# Altium project Temperature_PCB.PrjPcb
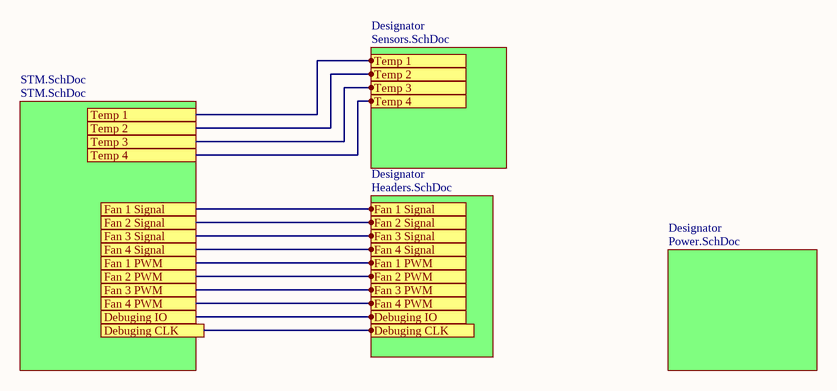
[diagram p0: TOP.SchDoc]
6 sheets, 44 parts. Net scope: global (net labels, ports and power ports of the same name join across sheets).
Board file: PCB.PcbDoc
Sheets:
  TOP.SchDoc
    STM.SchDoc = STM.SchDoc
      CAN = CANsetup.SchDoc
    Designator = Sensors.SchDoc
    Designator = Power.SchDoc
    Designator = Headers.SchDoc

## Sheet TOP.SchDoc: =DocumentName
size A4; Organization: Queen's Formula SAE; Address1: 130 Stuart St, Kingston; Address2: Ontario; Address3: Canada; Address4: K7L 2V9; DocumentNumber: 1; Revision: 0; SheetNumber: 1; SheetTotal: 1

### Sub-sheets
Designator = Sensors.SchDoc: Temp 1, Temp 2, Temp 3, Temp 4
Designator = Power.SchDoc: no entries
Designator = Headers.SchDoc: Fan 1 Signal, Fan 2 Signal, Fan 3 Signal, Fan 4 Signal, Fan 1 PWM, Fan 2 PWM, Fan 3 PWM, Fan 4 PWM, Debuging IO, Port
STM.SchDoc = STM.SchDoc: no entries

### Ports
Debuging CLK, Debuging IO, Fan 1 PWM, Fan 1 Signal, Fan 2 PWM, Fan 2 Signal, Fan 3 PWM, Fan 3 Signal, Fan 4 PWM, Fan 4 Signal, Temp 1, Temp 2, Temp 3, Temp 4

### Nets
Debuging CLK: port Debuging CLK, sheet Designator/Port
Debuging IO: port Debuging IO, sheet Designator/Debuging IO
Fan 1 PWM: port Fan 1 PWM, sheet Designator/Fan 1 PWM
Fan 1 Signal: port Fan 1 Signal, sheet Designator/Fan 1 Signal
Fan 2 PWM: port Fan 2 PWM, sheet Designator/Fan 2 PWM
Fan 2 Signal: port Fan 2 Signal, sheet Designator/Fan 2 Signal
Fan 3 PWM: port Fan 3 PWM, sheet Designator/Fan 3 PWM
Fan 3 Signal: port Fan 3 Signal, sheet Designator/Fan 3 Signal
Fan 4 PWM: port Fan 4 PWM, sheet Designator/Fan 4 PWM
Fan 4 Signal: port Fan 4 Signal, sheet Designator/Fan 4 Signal
Temp 1: port Temp 1, sheet Designator/Temp 1
Temp 2: port Temp 2, sheet Designator/Temp 2
Temp 3: port Temp 3, sheet Designator/Temp 3
Temp 4: port Temp 4, sheet Designator/Temp 4

### Notes on the sheet
- Title
- Size:
- Date:
- A4
- Number:
- Time:
- Revision:
- Sheet
- of
- File:

## Sheet STM.SchDoc
size A4
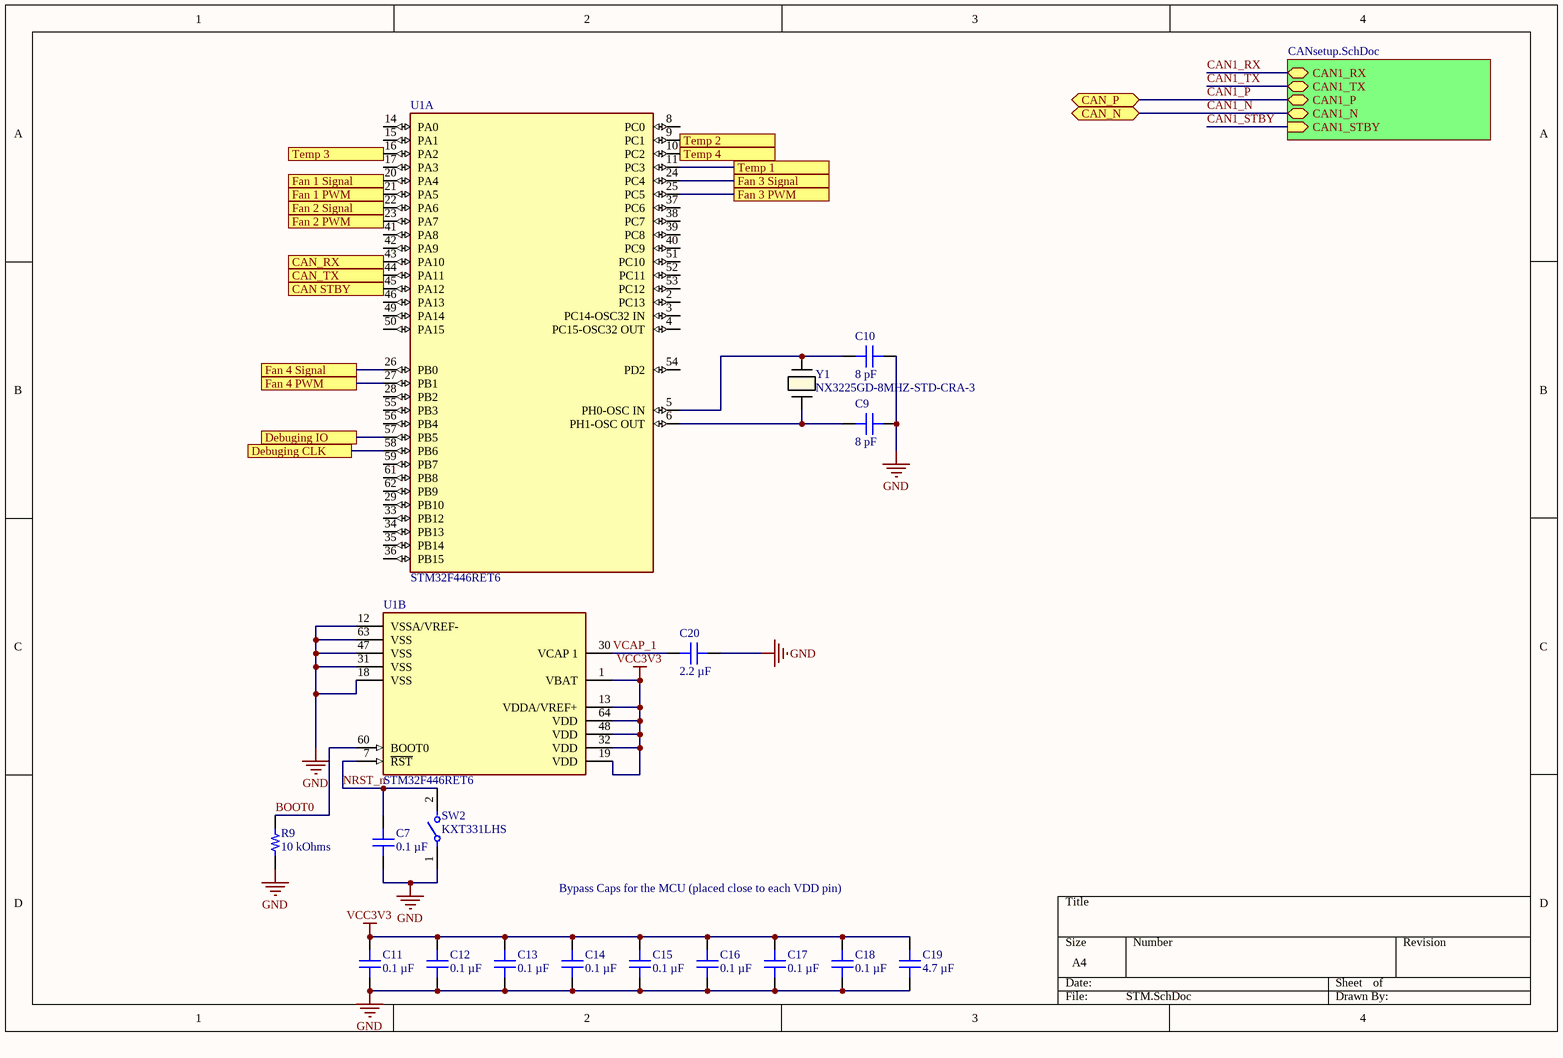
[diagram p1: STM.SchDoc]

### Parts
C7  0.1 µF  [CAP 01005_0402]
C9  8 pF  [CAP 0402_1005]
C10  8 pF  [CAP 0402_1005]
C11  0.1 µF  [CAP 01005_0402]
C12  0.1 µF  [CAP 01005_0402]
C13  0.1 µF  [CAP 01005_0402]
C14  0.1 µF  [CAP 01005_0402]
C15  0.1 µF  [CAP 01005_0402]
C16  0.1 µF  [CAP 01005_0402]
C17  0.1 µF  [CAP 01005_0402]
C18  0.1 µF  [CAP 01005_0402]
C19  4.7 µF  [CAP 0402_1005]
C20  2.2 µF  [CAP 0402_1005]
R9  10 kOhms  [RES 0201_0603]
SW2  KXT331LHS  [FP-KXT331LHS-MFG]
U1  STM32F446RET6  [FP-LQFP64-5W-MFG]  (parts A,B of 2)
Y1  NX3225GD-8MHZ-STD-CRA-3  [XTAL_NX3225GD-8MHZ-STD-CRA-3_NDK]

### Sub-sheets
CAN = CANsetup.SchDoc: CAN1_RX (bidir), CAN1_TX (bidir), CAN1_STBY (in), CAN1_P (bidir), CAN1_N (bidir)

### Ports
CAN STBY, CAN_N (bidir), CAN_P (bidir), CAN_RX, CAN_TX, Debuging CLK, Debuging IO, Fan 1 PWM, Fan 1 Signal, Fan 2 PWM, Fan 2 Signal, Fan 3 PWM, Fan 3 Signal, Fan 4 PWM, Fan 4 Signal, Temp 1, Temp 2, Temp 3, Temp 4

### Nets
GND: C7.2 C9.1 C10.1 C11.2 C12.2 C13.2 C14.2 C15.2 C16.2 C17.2 C18.2 C19.1 C20.1 R9.1 SW2.1 U1.12(VSSA/VREF-) U1.18(VSS) U1.31(VSS) U1.47(VSS) U1.63(VSS)
VCC3V3: C11.1 C12.1 C13.1 C14.1 C15.1 C16.1 C17.1 C18.1 C19.2 U1.1(VBAT) U1.13(VDDA/VREF+) U1.19(VDD) U1.32(VDD) U1.48(VDD) U1.64(VDD)
BOOT0: R9.2 U1.60(BOOT0)
CAN1_N: port CAN_N, sheet CAN/CAN1_N
CAN1_P: port CAN_P, sheet CAN/CAN1_P
CAN1_RX: sheet CAN/CAN1_RX
CAN1_STBY: sheet CAN/CAN1_STBY
CAN1_TX: sheet CAN/CAN1_TX
CAN STBY: U1.45(PA12) ; port CAN STBY
CAN_RX: U1.43(PA10) ; port CAN_RX
CAN_TX: U1.44(PA11) ; port CAN_TX
Debuging CLK: U1.58(PB6) ; port Debuging CLK
Debuging IO: U1.57(PB5) ; port Debuging IO
Fan 1 PWM: U1.21(PA5) ; port Fan 1 PWM
Fan 1 Signal: U1.20(PA4) ; port Fan 1 Signal
Fan 2 PWM: U1.23(PA7) ; port Fan 2 PWM
Fan 2 Signal: U1.22(PA6) ; port Fan 2 Signal
Fan 3 PWM: U1.25(PC5) ; port Fan 3 PWM
Fan 3 Signal: U1.24(PC4) ; port Fan 3 Signal
Fan 4 PWM: U1.27(PB1) ; port Fan 4 PWM
Fan 4 Signal: U1.26(PB0) ; port Fan 4 Signal
NRST_n: C7.1 SW2.2 U1.7(~{RST})
Temp 1: U1.11(PC3) ; port Temp 1
Temp 2: U1.9(PC1) ; port Temp 2
Temp 3: U1.16(PA2) ; port Temp 3
Temp 4: U1.10(PC2) ; port Temp 4
VCAP_1: C20.2 U1.30(VCAP_1)
NetC9_2: C9.2 U1.6(PH1-OSC_OUT) Y1.2
NetC10_2: C10.2 U1.5(PH0-OSC_IN) Y1.1

Not connected (* = marked no-connect by the designer): U1 2(PC13) 3(PC14-OSC32_IN) 4(PC15-OSC32_OUT) 8(PC0) 14(PA0) 15(PA1) 17(PA3) 28(PB2) 29(PB10) 33(PB12) 34(PB13) 35(PB14) 36(PB15) 37(PC6) 38(PC7) 39(PC8) 40(PC9) 41(PA8) 42(PA9) 46(PA13) 49(PA14) 50(PA15) 51(PC10) 52(PC11) 53(PC12) 54(PD2) 55(PB3) 56(PB4) 59(PB7) 61(PB8) 62(PB9)

### Notes on the sheet
- Bypass Caps for the MCU (placed close to each VDD pin)

### Library data of the parts
C7 C11-C18 = CL02A104KQ2NNNC: CAP CER 0.1UF 6.3V X5R 01005; manufacturer: Samsung Electro-Mechanics; Tolerance: ±10%; Part Number: CL02A104KQ2NNNC; Value: 0.1 µF; Applications: General Purpose; Capacitance: 0.1 µF; componentlink1description: Datasheet; componentlink1url: http://www.samsungsem.com/kr/support/product-search/mlcc/CL02A104KQ2NNNC.jsp; componentlink2description: DigiKey Link; componentlink2url: https://www.digikey.com/en/products/detail/samsung-electro-mechanics/CL02A104KQ2NNNC/3886867; Device Package: 01005 (0402 Metric); lastupdated: 2023-11-30 9:46:05 PM; Lifecycle Status: Active; Minimum Order: 1; Mounting Type: Surface Mount, MLCC; Operating Temperature: -55°C ~ 85°C; Package / Case: 01005 (0402 Metric); packaging: TapeAndReel; Part Status: Active; price: 0.02; series: CL; Size / Dimension: 0.016" L x 0.008" W (0.40mm x 0.20mm); Supplier 1: DigiKey; Supplier Part Number 1: 1276-1209-1-ND; Temperature Coefficient: X5R; Thickness (Max): 0.009" (0.22mm); Voltage - Rated: 6.3V
C9 C10 = GCM1555C1H8R0FA16D: CAP CER 8PF 50V C0G/NP0 0402; manufacturer: Murata Electronics; Temperature Coefficient: C0G, NP0; Tolerance: ±1%; Part Number: GCM1555C1H8R0FA16D; Value: 8 pF; Applications: Automotive; Capacitance: 8 pF; componentlink1description: Datasheet; componentlink1url: https://search.murata.co.jp/Ceramy/image/img/A01X/G101/ENG/GCM1555C1H8R0FA16-01.pdf; componentlink2description: DigiKey Link; componentlink2url: https://www.digikey.com/en/products/detail/murata-electronics/GCM1555C1H8R0FA16D/11618789; Device Package: 0402 (1005 Metric); lastupdated: 2024-01-11 8:04:05 PM; Lifecycle Status: Active; Minimum Order: 1; Mounting Type: Surface Mount, MLCC; Operating Temperature: -55°C ~ 125°C; Package / Case: 0402 (1005 Metric); packaging: TapeAndReel; partid: 34002; Part Status: Active; price: 0.01; Ratings: AEC-Q200; series: GCM; Size / Dimension: 0.039" L x 0.020" W (1.00mm x 0.50mm); Supplier 1: DigiKey; Supplier Part Number 1: 490-GCM1555C1H8R0FA16DCT-ND; Thickness (Max): 0.022" (0.55mm); Voltage - Rated: 50V
C19 = CL05A475MO5NUNC: CAP CER 4.7UF 16V X5R 0402; manufacturer: Samsung Electro-Mechanics; Tolerance: ±20%; Part Number: CL05A475MO5NUNC; Value: 4.7 µF; Applications: General Purpose; Capacitance: 4.7 µF; componentlink1description: Datasheet; componentlink1url: http://www.samsungsem.com/kr/support/product-search/mlcc/__icsFiles/afieldfile/2019/05/29/Data%20sheet_CL05A475MO5NUNC.pdf; componentlink2description: DigiKey Link; componentlink2url: https://www.digikey.com/en/products/detail/samsung-electro-mechanics/CL05A475MO5NUNC/5961320; Device Package: 0402 (1005 Metric); lastupdated: 2024-01-11 8:04:27 PM; Lifecycle Status: Active; Minimum Order: 1; Mounting Type: Surface Mount, MLCC; Operating Temperature: -55°C ~ 85°C; Package / Case: 0402 (1005 Metric); packaging: TapeAndReel; partid: 1760; Part Status: Active; price: 0.08; series: CL; Size / Dimension: 0.039" L x 0.020" W (1.00mm x 0.50mm); Supplier 1: DigiKey; Supplier Part Number 1: 1276-6836-1-ND; Temperature Coefficient: X5R; Thickness (Max): 0.028" (0.70mm); Voltage - Rated: 16V
C20 = CL05A225KO5NQNC: CAP CER 2.2UF 16V X5R 0402; manufacturer: Samsung Electro-Mechanics; Tolerance: ±10%; Part Number: CL05A225KO5NQNC; Value: 2.2 µF; Applications: General Purpose; Capacitance: 2.2 µF; componentlink1description: Datasheet; componentlink1url: http://www.samsungsem.com/kr/support/product-search/mlcc/CL05A225KO5NQNC.jsp; componentlink2description: DigiKey Link; componentlink2url: https://www.digikey.com/en/products/detail/samsung-electro-mechanics/CL05A225KO5NQNC/3887119; Device Package: 0402 (1005 Metric); lastupdated: 2024-01-11 8:04:27 PM; Lifecycle Status: Active; Minimum Order: 1; Mounting Type: Surface Mount, MLCC; Operating Temperature: -55°C ~ 85°C; Package / Case: 0402 (1005 Metric); packaging: TapeAndReel; partid: 1761; Part Status: Active; price: 0.03; series: CL; Size / Dimension: 0.039" L x 0.020" W (1.00mm x 0.50mm); Supplier 1: DigiKey; Supplier Part Number 1: 1276-1461-1-ND; Temperature Coefficient: X5R; Thickness (Max): 0.022" (0.55mm); Voltage - Rated: 16V
R9 = CRCW020110K0FKED: RES SMD 10K OHM 1% 1/20W 0201; Manufacturer: Vishay Dale; Power (Watts): 0.05W, 1/20W; Temperature Coefficient: ±100ppm/°C; Part Number: CRCW020110K0FKED; Value: 10 kOhms; ComponentLink1Description: Datasheet; ComponentLink1URL: http://www.vishay.com/docs/20052/crcw0201e3.pdf; ComponentLink2Description: DigiKey Link; ComponentLink2URL: https://www.digikey.com/en/products/detail/vishay-dale/CRCW020110K0FKED/1967989; Composition: Thick Film; Device Package: 0201 (0603 Metric); Height - Seated (Max): 0.010" (0.26mm); LastUpdated: 2024-01-11 8:21:19 PM; Lifecycle Status: Active; Minimum Order: 1; Number of Terminations: 2; Operating Temperature: -55°C ~ 155°C; Package / Case: 0201 (0603 Metric); Packaging: TapeAndReel; PartId: 29; Part Status: Active; Price: 0.02; Resistance: 10 kOhms; Series: CRCW; Size / Dimension: 0.024" L x 0.012" W (0.60mm x 0.30mm); Supplier 1: DigiKey; Supplier Part Number 1: 541-10.0KAABCT-ND; Supplier Device Package: 0201; Tolerance: ±1%
SW2 = CMP-10040-000029-1: SWITCH TACTILE SPST-NO 0.02A 15V; Operating Force: 240gf; Switch Travel: 0.13mm; Illumination Type: Non-Illuminated; Throw Configuration: SPST; Number of Ports: 1; Current Rating: 5A; Mechanical Life: 500000Cycles; Switch Function: Off-Mom; Connector Type: USB; Actuator Type: Standard; Gender: Receptacle; Number of Contacts: 24; Contact Plating: Gold; Insulation Color: Black; Min Operating Temperature: -40°C; Packaging: Tape and Reel; Flammability Rating: UL94 V-0; Max Operating Temperature: 85°C; Termination: Solder; Mount: Surface Mount
U1 = CMP-12105-000007-1: IC MCU 32BIT 512KB FLASH 64LQFP; Manufacturer: ST; Number Of Spi Channels: 4; Ram Size: 128KBytes; Standoff Height: 0.05mm; Number Of Uart Channels: 6; Number Of Pwm Channels: 32; Max Junction Temp: +105°C; Number Of I/Os: 50; Number Of Usb Channels: 2; Frequency: 180MHz; Number Of A/D Converters: 3; Max Supply Voltage: 3.6V; Number Of Adc Channels: 16; Interface: I2C,SPI,UART,USART,CAN,USB,LIN,IrDA,I2S,Other; Memory Size: 512KBytes; Number Of Timers/Counters: 14; Min Supply Voltage: 1.7V; Core Architecture: ARM Cortex-M4; Data Bus Width: 32bits; Number Of Cores: 1; Ambient Temperature Range Low: -40°C; ComponentLink2URL: https://www.st.com/en/microcontrollers-microprocessors/stm32f446re.html; Category: IC; Height: 1.6mm; Ipc Land Pattern Name: QFP50P1200X1200X160-64; Manufacturer Part Number: STM32F446RET6; Octopart: https://octopart.com/stm32f446ret6-stmicroelectronics-52642920; Temperature Range High: +105°C; Lead Free: Yes; Mouser Description: ARM Microcontrollers - MCU High-performance and DSP with FP, ARM Cortex-M4 MCU with 512 Kbytes Flash, 180 MHz CPU, Art Accelerator, SDRAM; Digikey Description: IC MCU 32BIT 512KB FLASH 64LQFP; Ambient Temperature Range High: +85°C; Number Of I2C Channels: 4; Memory Type: FLASH; RoHS: TRUE; Automotive: No; Device Class L1: Integrated Circuits (ICs); Temperature: -40°C to +105°C; Device Class L2: Embedded Processors and Controllers; Device Class L3: Microcontrollers; Temperature Range Low: -40°C; Package: LQFP64-5W; ComponentLink2Description: Datasheet
Y1 = NX3225GD-8MHZ-STD-CRA-3: No Description Available; Mfr_Name: NDK; Copyright: Copyright (C) 2024 Ultra Librarian. All rights reserved.; Manufacturer_Part_Number: NX3225GD-8MHZ-STD-CRA-3; RefDes: RefDes; Type: DEV

## Sheet CANsetup.SchDoc
size A4
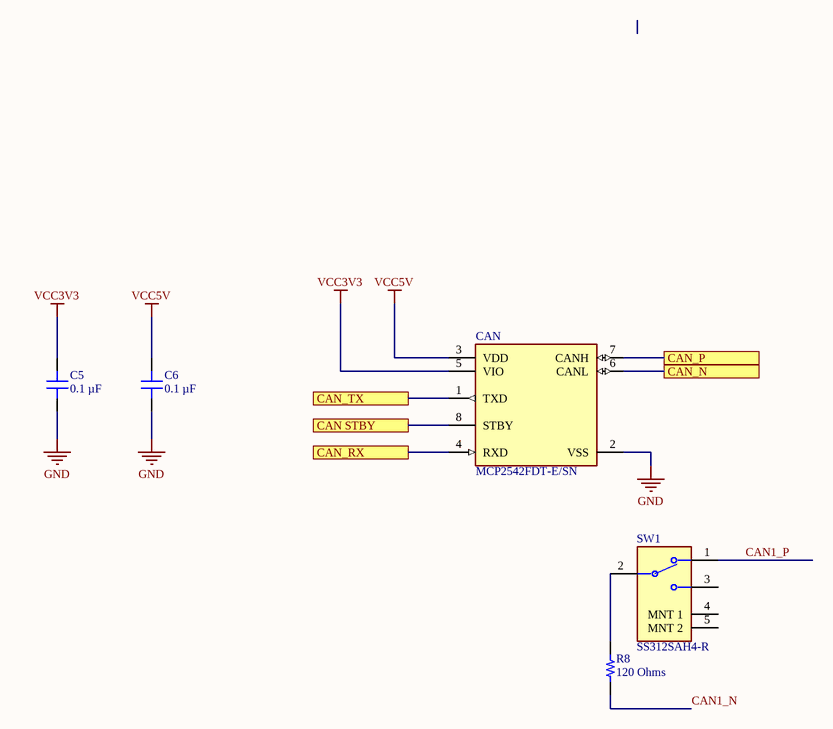
[diagram p2: CANsetup.SchDoc]

### Parts
C5  0.1 µF  [CAP 01005_0402]
C6  0.1 µF  [CAP 01005_0402]
CAN  MCP2542FDT-E/SN  [FP-C04-057-SN-IPC_C]
R8  120 Ohms  [RES 0201_0603]
SW1  SS312SAH4-R  [FP-SS312SAH4-R-MFG]

### Ports
CAN STBY, CAN_N, CAN_P, CAN_RX, CAN_TX

### Nets
GND: C5.2 C6.2 CAN.2(VSS)
VCC3V3: C5.1 CAN.5(VIO)
VCC5V: C6.1 CAN.3(VDD)
CAN1_N: CAN.6(CANL) R8.2 ; port CAN_N
CAN1_P: CAN.7(CANH) SW1.1 ; port CAN_P
CAN STBY: CAN.8(STBY) ; port CAN STBY
CAN_RX: CAN.4(RXD) ; port CAN_RX
CAN_TX: CAN.1(TXD) ; port CAN_TX
NetR8_1: R8.1 SW1.2(COM)

Not connected (* = marked no-connect by the designer): SW1 3 4(MNT_1) 5(MNT_2)

### Library data of the parts
C5 C6 = CL02A104KQ2NNNC: as C7 on sheet STM; Part Number: CL02A104KQ2NNNC; Value: 0.1 µF; Applications: General Purpose; Capacitance: 0.1 µF; componentlink1description: Datasheet; componentlink1url: http://www.samsungsem.com/kr/support/product-search/mlcc/CL02A104KQ2NNNC.jsp; componentlink2description: DigiKey Link; componentlink2url: https://www.digikey.com/en/products/detail/samsung-electro-mechanics/CL02A104KQ2NNNC/3886867; Device Package: 01005 (0402 Metric); lastupdated: 2023-11-30 9:46:05 PM; Lifecycle Status: Active; Minimum Order: 1; Mounting Type: Surface Mount, MLCC; Operating Temperature: -55°C ~ 85°C; Package / Case: 01005 (0402 Metric); packaging: TapeAndReel; Part Status: Active; price: 0.02; series: CL; Size / Dimension: 0.016" L x 0.008" W (0.40mm x 0.20mm); Supplier 1: DigiKey; Supplier Part Number 1: 1276-1209-1-ND; Temperature Coefficient: X5R; Thickness (Max): 0.009" (0.22mm); Voltage - Rated: 6.3V
CAN = CMP-06279-000006-1: IC TRANSCEIVER 1/1 8SOIC; Data Rate: 8Mbps; Receiver Hysteresis: 200mV; Min Operating Temperature: -40°C; Mount: Surface Mount; Case/Package: SOIC; Max Operating Temperature: 125°C; Packaging: Rail/Tube
R8 = RMCF0201JT120R: RES 120 OHM 5% 1/20W 0201; Manufacturer: Stackpole Electronics Inc; Power (Watts): 0.05W, 1/20W; Temperature Coefficient: ±200ppm/°C; Part Number: RMCF0201JT120R; Value: 120 Ohms; ComponentLink1Description: Datasheet; ComponentLink1URL: https://www.seielect.com/catalog/sei-rmcf_rmcp.pdf; ComponentLink2Description: DigiKey Link; ComponentLink2URL: https://www.digikey.com/en/products/detail/stackpole-electronics-inc/RMCF0201JT120R/5966040; Composition: Thick Film; Device Package: 0201 (0603 Metric); Height - Seated (Max): 0.010" (0.26mm); LastUpdated: 2023-11-30 8:20:29 PM; Lifecycle Status: Active; Minimum Order: 1; Number of Terminations: 2; Operating Temperature: -55°C ~ 155°C; Package / Case: 0201 (0603 Metric); Packaging: CutTape; PartId: 197; Part Status: Active; Price: 0.01; Ratings: AEC-Q200; Resistance: 120 Ohms; Series: RMCF; Size / Dimension: 0.024" L x 0.012" W (0.60mm x 0.30mm); Supplier 1: DigiKey; Supplier Part Number 1: 738-RMCF0201JT120RCT-ND; Supplier Device Package: 0201; Tolerance: ±5%
SW1 = CMP-31746-000001-1: SWITCH SLIDE SPDT 0.4VA 28V; Mechanical Life: 10000Cycles; Switch Function: On-On; Actuator Length: 2mm; Contact Style: Shorting; Max Current Rating: 100mA; Actuator Type: Standard; Actuator Material: Polyphenylene; Length: 10.5mm; Orientation: Right Angle; Voltage Rating (DC): 28V; Contact Material: Bronze; Electrical Life: 10000Cycles; Max Operating Temperature: 85°C; Case/Package: SMD/SMT; Depth: 7.45mm; Contact Plating: Gold; Voltage Rating (AC): 28V; Package Quantity: 1; Min Operating Temperature: -25°C; Switch Travel: 2mm; Housing Material: Bronze; RoHS Compliant: Yes; Lead Free: Lead Free; Termination: Gull Wing; Packaging: Tape and Reel; REACH SVHC: No SVHC; Mount: Surface Mount; Series: SS3; Throw Configuration: SPDT; Max Voltage Rating (AC): 28V; Max Voltage Rating (DC): 28V

## Sheet Sensors.SchDoc
size A4
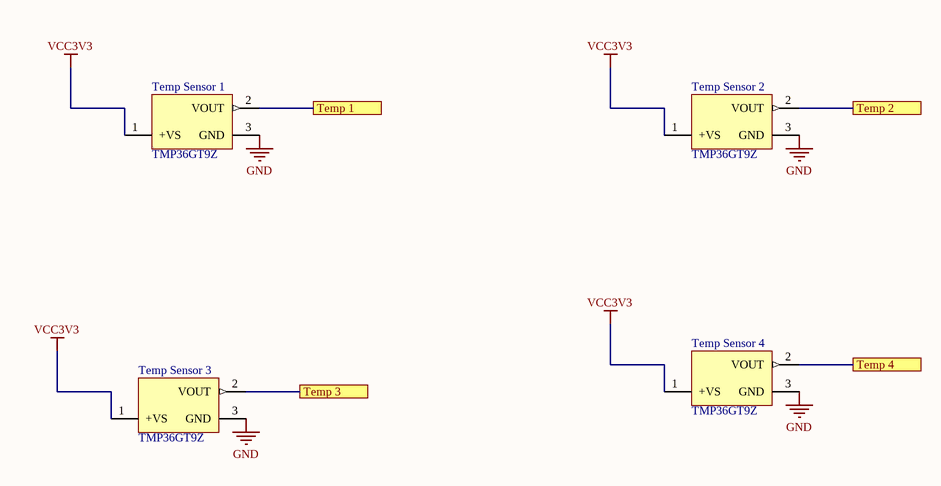
[diagram p3: Sensors.SchDoc]

### Parts
Temp_Sensor_1  TMP36GT9Z  [ADI-T-3]
Temp_Sensor_2  TMP36GT9Z  [ADI-T-3]
Temp_Sensor_3  TMP36GT9Z  [ADI-T-3]
Temp_Sensor_4  TMP36GT9Z  [ADI-T-3]

### Ports
Temp 1, Temp 2, Temp 3, Temp 4

### Nets
GND: Temp_Sensor_1.3(GND) Temp_Sensor_2.3(GND) Temp_Sensor_3.3(GND) Temp_Sensor_4.3(GND)
VCC3V3: Temp_Sensor_1.1(+VS) Temp_Sensor_2.1(+VS) Temp_Sensor_3.1(+VS) Temp_Sensor_4.1(+VS)
Temp 1: Temp_Sensor_1.2(VOUT) ; port Temp 1
Temp 2: Temp_Sensor_2.2(VOUT) ; port Temp 2
Temp 3: Temp_Sensor_3.2(VOUT) ; port Temp 3
Temp 4: Temp_Sensor_4.2(VOUT) ; port Temp 4

### Library data of the parts
Temp_Sensor_1-Temp_Sensor_4 = CMP-0887-00067-1: Low Voltage Temperature Sensor, 2.7 to 5.5 V Supply, Industrial, 3-pin TO92 (T-3), Tray; Manufacturer: Analog Devices; ComponentLink2Description: Datasheet; PackageReference: T-3; Packing: Tray; ComponentLink2URL: http://www.analog.com/static/imported-files/data_sheets/TMP35_36_37.pdf; ComponentLink4Description: Product URL; ComponentLink3Description: Package Specification; Code_JEDEC: TO-226-AA; PartNumber: TMP36GT9Z; PackageDescription: 3-Pin Plastic Header-Style Package, 1.27 mm Pitch; PackageVersion: 042208-A, 04/2008; ComponentLink3URL: http://www.analog.com/static/imported-files/packages/PKG_PDF/TO-92(T)/T_3.pdf; ComponentLink1Description: Manufacturer URL; Supply Voltage Range: 2.7 to 5.5 V; Mounting Technology: Through Hole; DatasheetVersion: Rev. F; ComponentLink4URL: http://www.analog.com/en/mems-sensors/digital-temperature-sensors/tmp36/products/product.html; ComponentLink1URL: http://www.analog.com/en/index.html

## Sheet Power.SchDoc
size A4
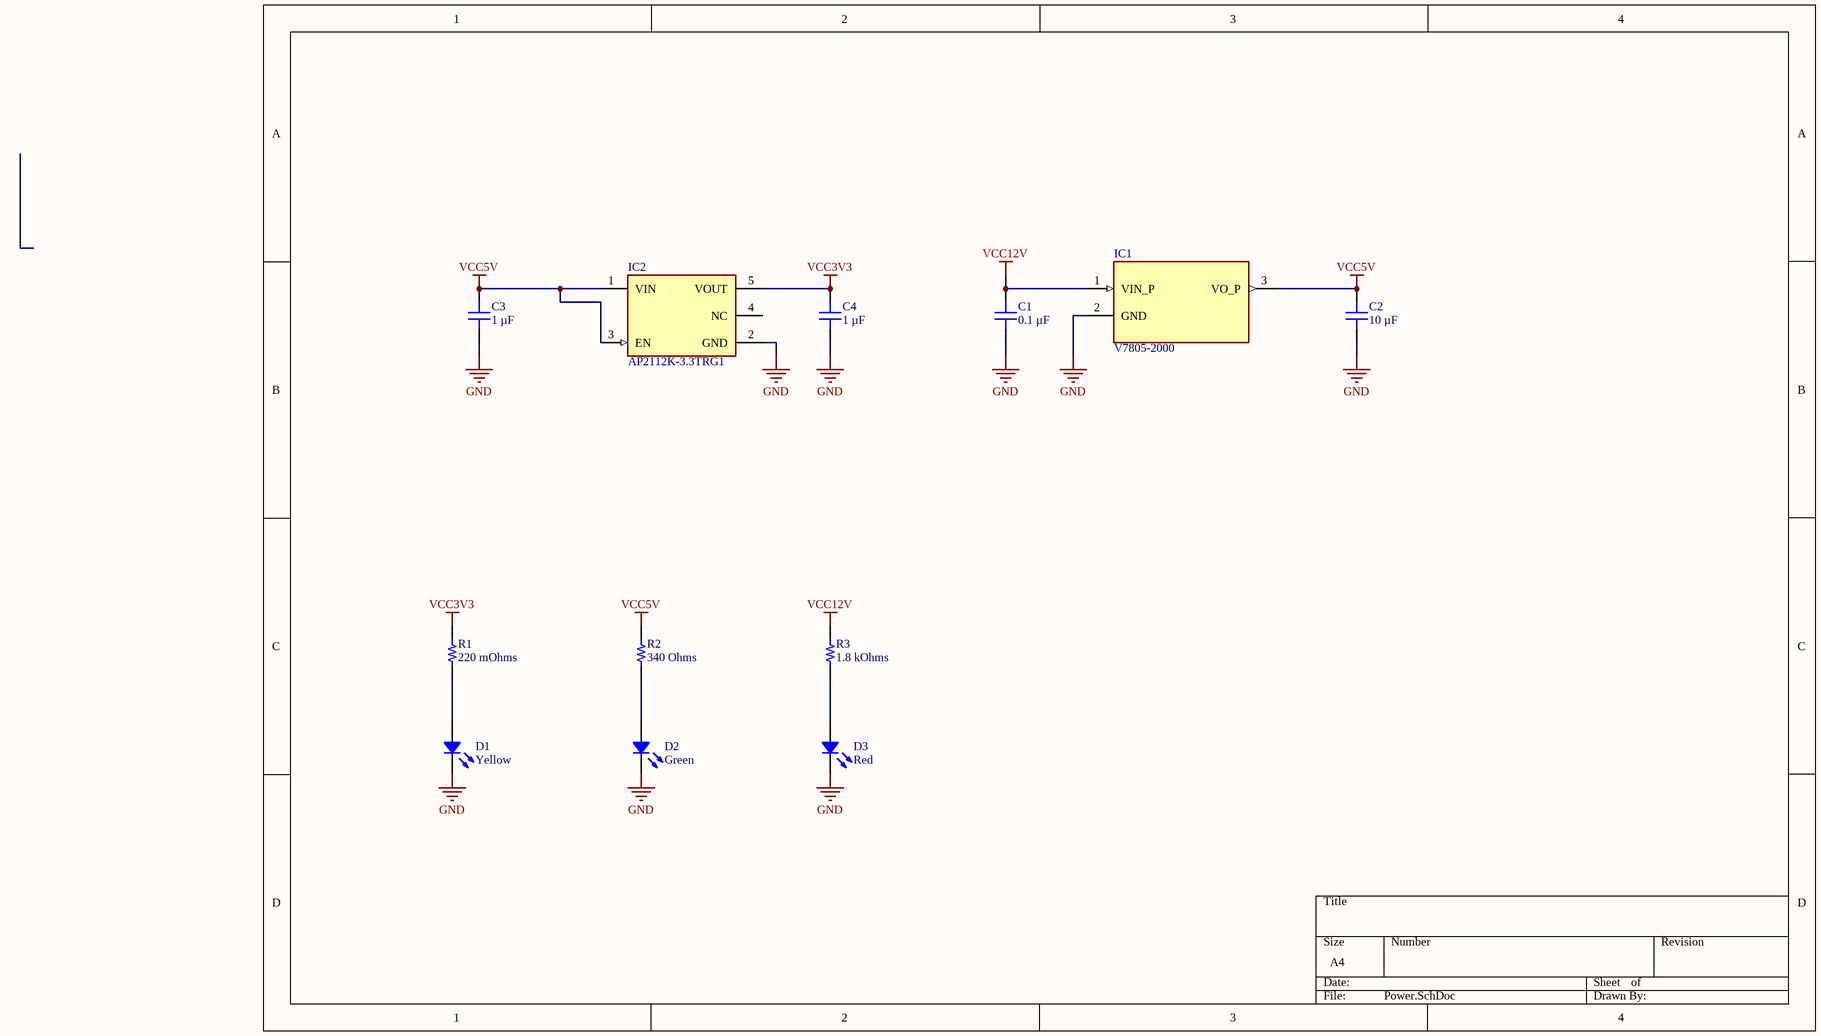
[diagram p4: Power.SchDoc]

### Parts
C1  0.1 µF  [CAP 0201_0603]
C2  10 µF  [CAP 0402_1005]
C3  1 µF  [CAP 0201_0603]
C4  1 µF  [CAP 0201_0603]
D1  Yellow  [LED 1206_3216 YELLOW]
D2  Green  [LED 0805_2012 GREEN]
D3  Red  [LED 1206_3216 RED]
IC1  V7805-2000  [CONV_V7805-2000]
IC2  AP2112K-3.3TRG1  [FP-SOT25-IPC_A]
R1  220 mOhms  [RES 0201_0603]
R2  340 Ohms  [RES 0201_0603]
R3  1.8 kOhms  [RES 0201_0603]

### Nets
GND: C1.1 C2.1 C3.1 C4.1 D1.2 D2.2 D3.2 IC1.2(GND) IC2.2(GND)
VCC3V3: C4.2 IC2.5(VOUT) R1.2
VCC5V: C2.2 C3.2 IC1.3(VO_P) IC2.1(VIN) IC2.3(EN) R2.2
VCC12V: C1.2 IC1.1(VIN_P) R3.2
NetD1_1: D1.1 R1.1
NetD2_1: D2.1 R2.1
NetD3_1: D3.1 R3.1

Not connected (* = marked no-connect by the designer): IC2 4(NC)

### Library data of the parts
C1 = EMK063BJ104MP-F: CAP CER 0.1UF 16V X5R 0201; manufacturer: Taiyo Yuden; Tolerance: ±20%; Part Number: EMK063BJ104MP-F; Value: 0.1 µF; Applications: SMPS Filtering; Capacitance: 0.1 µF; componentlink1description: Datasheet; componentlink1url: https://ds.yuden.co.jp/TYCOMPAS/ut/detail?pn=EMK063BJ104MP-F &u=M; componentlink2description: DigiKey Link; componentlink2url: https://www.digikey.com/en/products/detail/taiyo-yuden/EMK063BJ104MP-F/7403527; Device Package: 0201 (0603 Metric); lastupdated: 2024-01-11 8:00:55 PM; Lifecycle Status: Active; Minimum Order: 1; Mounting Type: Surface Mount, MLCC; Operating Temperature: -55°C ~ 85°C; Package / Case: 0201 (0603 Metric); packaging: CutTape; partid: 79; Part Status: Active; price: 0.01; series: M; Size / Dimension: 0.024" L x 0.012" W (0.60mm x 0.30mm); Supplier 1: DigiKey; Supplier Part Number 1: 587-6302-1-ND; Temperature Coefficient: X5R; Thickness (Max): 0.015" (0.39mm); Voltage - Rated: 16V
C2 = CL05A106MP8NUB8: CAP CER 10UF 10V X5R 0402; manufacturer: Samsung Electro-Mechanics; Tolerance: ±20%; Part Number: CL05A106MP8NUB8; Value: 10 µF; Applications: Acoustic Noise Reduction; Capacitance: 10 µF; componentlink1description: Datasheet; componentlink1url: http://www.samsungsem.com/kr/support/product-search/mlcc/CL05A106MP8NUB8.jsp; componentlink2description: DigiKey Link; componentlink2url: https://www.digikey.com/en/products/detail/samsung-electro-mechanics/CL05A106MP8NUB8/5961314; Device Package: 0402 (1005 Metric); lastupdated: 2024-01-11 8:04:27 PM; Lifecycle Status: Active; Minimum Order: 1; Mounting Type: Surface Mount, MLCC; Operating Temperature: -55°C ~ 85°C; Package / Case: 0402 (1005 Metric); packaging: TapeAndReel; partid: 1758; Part Status: Active; price: 0.06; series: CL; Size / Dimension: 0.039" L x 0.020" W (1.00mm x 0.50mm); Supplier 1: DigiKey; Supplier Part Number 1: 1276-6830-1-ND; Temperature Coefficient: X5R; Thickness (Max): 0.035" (0.90mm); Voltage - Rated: 10V
C3 C4 = CL03A105MQ3CSNC: CAP CER 1UF 6.3V X5R 0201; manufacturer: Samsung Electro-Mechanics; Tolerance: ±20%; Part Number: CL03A105MQ3CSNC; Value: 1 µF; Applications: General Purpose; Capacitance: 1 µF; componentlink1description: Datasheet; componentlink1url: http://www.samsungsem.com/kr/support/product-search/mlcc/CL03A105MQ3CSNC.jsp; componentlink2description: DigiKey Link; componentlink2url: https://www.digikey.com/en/products/detail/samsung-electro-mechanics/CL03A105MQ3CSNC/3886983; Device Package: 0201 (0603 Metric); lastupdated: 2024-01-11 8:00:55 PM; Lifecycle Status: Active; Minimum Order: 1; Mounting Type: Surface Mount, MLCC; Operating Temperature: -55°C ~ 85°C; Package / Case: 0201 (0603 Metric); packaging: TapeAndReel; partid: 93; Part Status: Active; price: 0.01; series: CL; Size / Dimension: 0.024" L x 0.012" W (0.60mm x 0.30mm); Supplier 1: DigiKey; Supplier Part Number 1: 1276-1325-1-ND; Temperature Coefficient: X5R; Thickness (Max): 0.013" (0.33mm); Voltage - Rated: 6.3V
D1 = 25-21UYC/S530-A2/TR8: LED YELLOW CLEAR 2SMD; Manufacturer: Everlight Electronics Co Ltd; Configuration: Standard; Current - Test: 20mA; Lens Color: Colorless; Lens Size: 1.10mm Dia; Lens Style: Round with Domed Top; Millicandela Rating: 45mcd; Viewing Angle: 60°; Voltage - Forward (Vf) (Typ): 2V; Wavelength - Dominant: 589nm; Wavelength - Peak: 591nm; Part Number: 25-21UYC/S530-A2/TR8; Color: Yellow; ComponentLink1Description: Datasheet; ComponentLink1URL: //media.digikey.com/pdf/Data%20Sheets/Everlight%20PDFs/25-21UYC-S530-A2-TR8_V6_11-12-18.pdf; ComponentLink2Description: DigiKey Link; ComponentLink2URL: https://www.digikey.com/en/products/detail/everlight-electronics-co-ltd/25-21UYC-S530-A2-TR8/8535289; Device Package: 1206 (3216 Metric); Height (Max): 1.20mm; LastUpdated: 2023-08-19 8:22:38 PM; Lens Transparency: Clear; Lifecycle Status: Active; Minimum Order: 1; Mounting Type: Surface Mount; Package / Case: 1206 (3216 Metric); Packaging: TapeAndReel; PartId: 2; Part Status: Active; Price: 0.08; Series: -; Size / Dimension: 3.20mm L x 1.60mm W; Supplier 1: DigiKey; Supplier Part Number 1: 1080-1595-1-ND; Supplier Device Package: 2-SMD; Value: Yellow
D2 = QTLP630C4TR: LED GREEN CLEAR 0805 SMD; Manufacturer: Everlight Electronics Co Ltd; Configuration: Standard; Current - Test: 20mA; Lens Color: Colorless; Lens Size: 1.40mm x 1.25mm; Lens Style: Rectangle with Flat Top; Millicandela Rating: 10mcd; Viewing Angle: 140°; Voltage - Forward (Vf) (Typ): 2.1V; Wavelength - Dominant: 570nm; Wavelength - Peak: 565nm; Part Number: QTLP630C4TR; Color: Green; ComponentLink1Description: Datasheet; ComponentLink1URL: //media.digikey.com/PDF/Data%20Sheets/Everlight%20PDFs/QTLP630-2.pdf; ComponentLink2Description: DigiKey Link; ComponentLink2URL: https://www.digikey.com/en/products/detail/everlight-electronics-co-ltd/QTLP630C4TR/2675902; Device Package: 0805 (2012 Metric); Height (Max): 1.20mm; LastUpdated: 2023-08-19 8:21:40 PM; Lens Transparency: Clear; Lifecycle Status: Active; Minimum Order: 1; Mounting Type: Surface Mount; Package / Case: 0805 (2012 Metric); Packaging: TapeAndReel; PartId: 240; Part Status: Active; Price: 0.05; Series: -; Size / Dimension: 2.00mm L x 1.25mm W; Supplier 1: DigiKey; Supplier Part Number 1: 1080-1411-1-ND; Supplier Device Package: 0805; Value: Green
D3 = XZMDK55W-A2RT: LED RED CLEAR 2SMD; Manufacturer: SunLED; Configuration: Standard; Current - Test: 20mA; Lens Color: Colorless; Lens Size: 1.10mm Dia; Lens Style: Round with Flat Top; Millicandela Rating: 228mcd; Viewing Angle: 70°; Voltage - Forward (Vf) (Typ): 1.95V; Wavelength - Dominant: 630nm; Wavelength - Peak: 645nm; Part Number: XZMDK55W-A2RT; Color: Red; ComponentLink1Description: Datasheet; ComponentLink1URL: https://www.sunledusa.com/products/spec/XZMDK55W-A2RT.pdf; ComponentLink2Description: DigiKey Link; ComponentLink2URL: https://www.digikey.com/en/products/detail/sunled/XZMDK55W-A2RT/5775264; Device Package: 1206 (3216 Metric); Height (Max): 1.20mm; LastUpdated: 2023-08-19 8:21:50 PM; Lens Transparency: Clear; Lifecycle Status: Active; Minimum Order: 1; Mounting Type: Surface Mount; Package / Case: 1206 (3216 Metric); Packaging: TapeAndReel; PartId: 183; Part Status: Active; Price: 0.06; Series: -; Size / Dimension: 3.20mm L x 1.60mm W; Supplier 1: DigiKey; Supplier Part Number 1: 1497-1289-1-ND; Supplier Device Package: 2-SMD; Value: Red
IC1 = V7805-2000: 2 A Output Current, 4.75~18 Vdc Input, 3 Pin SIP, Non-Isolated, Dc-Dc Converter; MF: CUI Inc.; DigiKey-Purchase-URL: https://snapeda.com/shop?store=DigiKey&id=2773183; Package: SIP-3 CUI; Value: *; MP: V7805-2000; CUI_purchase_URL: https://www.cui.com/product/dc-dc-converters/non-isolated/v78-2000-series?utm_source=snapeda.com&utm_medium=referral&utm_campaign=snapedaBOM; SnapEDA_Link: https://www.snapeda.com/parts/V7805-2000/CUI/view-part/2773183/?ref=snap; Digi-Key_Part_Number: 102-2188-ND
IC2 = CMP-12756-000035-1: IC REG LINEAR 3.3V 600MA SOT25; Number of Regulators: 1; Output Type: Fixed; Polarity: Positive; Min Input Voltage: 2.5V; Max Input Voltage: 6V; Accuracy: 1.5%; Quiescent Current: 55uA; Dropout Voltage: 250mV; Min Operating Temperature: -40°C; Length: 3.1mm; Output Current: 600mA; Max Operating Temperature: 85°C; Package Quantity: 1; Output Voltage: 3.3V; Width: 1.7mm; Number of Outputs: 1; Packaging: Tape and Reel; Height: 1.3mm; Lead Free: Lead Free; Max Output Current: 600mA; Case/Package: SOT-23-5; Mount: Surface Mount; Number of Pins: 5
R1 = UCR006YVPFLR220: RES 0.22 OHM 1% 1/10W 0201; Manufacturer: Rohm Semiconductor; Power (Watts): 0.1W, 1/10W; Temperature Coefficient: 0/ +300ppm/°C; Part Number: UCR006YVPFLR220; Value: 220 mOhms; ComponentLink1Description: Datasheet; ComponentLink1URL: https://www.rohm.com/datasheet/UCR10EVHJS/ucr-e; ComponentLink2Description: DigiKey Link; ComponentLink2URL: https://www.digikey.com/en/products/detail/rohm-semiconductor/UCR006YVPFLR220/5247873; Composition: Thick Film; Device Package: 0201 (0603 Metric); Features: Current Sense; Height - Seated (Max): 0.011" (0.28mm); LastUpdated: 2023-08-19 7:17:26 PM; Lifecycle Status: Active; Minimum Order: 1; Number of Terminations: 2; Operating Temperature: -55°C ~ 155°C; Package / Case: 0201 (0603 Metric); Packaging: TapeAndReel; PartId: 108; Part Status: Active; Price: 0.12; Resistance: 220 mOhms; Series: UCR; Size / Dimension: 0.024" L x 0.013" W (0.60mm x 0.33mm); Supplier 1: DigiKey; Supplier Part Number 1: RHM1702-1-ND; Supplier Device Package: 0201; Tolerance: ±1%
R2 = AC0201FR-07340RL: RES SMD 340 OHM 1% 1/20W 0201; Manufacturer: Yageo; Power (Watts): 0.05W, 1/20W; Temperature Coefficient: ±200ppm/°C; Part Number: AC0201FR-07340RL; Value: 340 Ohms; ComponentLink1Description: Datasheet; ComponentLink1URL: https://www.yageo.com/upload/media/product/productsearch/datasheet/rchip/PYu-AC_51_RoHS_L_7.pdf; ComponentLink2Description: DigiKey Link; ComponentLink2URL: https://www.digikey.com/en/products/detail/yageo/AC0201FR-07340RL/5894560; Composition: Thick Film; Device Package: 0201 (0603 Metric); Features: Automotive AEC-Q200, Moisture Resistant; Height - Seated (Max): 0.010" (0.26mm); LastUpdated: 2023-08-19 7:17:26 PM; Lifecycle Status: Active; Minimum Order: 1; Number of Terminations: 2; Operating Temperature: -55°C ~ 155°C; Package / Case: 0201 (0603 Metric); Packaging: TapeAndReel; PartId: 145; Part Status: Active; Price: 0.01; Ratings: AEC-Q200; Resistance: 340 Ohms; Series: AC; Size / Dimension: 0.024" L x 0.012" W (0.60mm x 0.30mm); Supplier 1: DigiKey; Supplier Part Number 1: YAG5199CT-ND; Supplier Device Package: 0201; Tolerance: ±1%
R3 = CRCW02011K80JNED: RES SMD 1.8K OHM 5% 1/20W 0201; Manufacturer: Vishay Dale; Power (Watts): 0.05W, 1/20W; Temperature Coefficient: ±200ppm/°C; Part Number: CRCW02011K80JNED; Value: 1.8 kOhms; ComponentLink1Description: Datasheet; ComponentLink1URL: http://www.vishay.com/docs/20052/crcw0201e3.pdf; ComponentLink2Description: DigiKey Link; ComponentLink2URL: https://www.digikey.com/en/products/detail/vishay-dale/CRCW02011K80JNED/1199542; Composition: Thick Film; Device Package: 0201 (0603 Metric); Height - Seated (Max): 0.010" (0.26mm); LastUpdated: 2023-08-19 7:17:24 PM; Lifecycle Status: Active; Minimum Order: 1; Number of Terminations: 2; Operating Temperature: -55°C ~ 155°C; Package / Case: 0201 (0603 Metric); Packaging: CutTape; PartId: 479; Part Status: Active; Price: 0.01; Resistance: 1.8 kOhms; Series: CRCW; Size / Dimension: 0.024" L x 0.012" W (0.60mm x 0.30mm); Supplier 1: DigiKey; Supplier Part Number 1: 541-CRCW02011K80JNEDCT-ND; Supplier Device Package: 0201; Tolerance: ±5%

## Sheet Headers.SchDoc
size A4
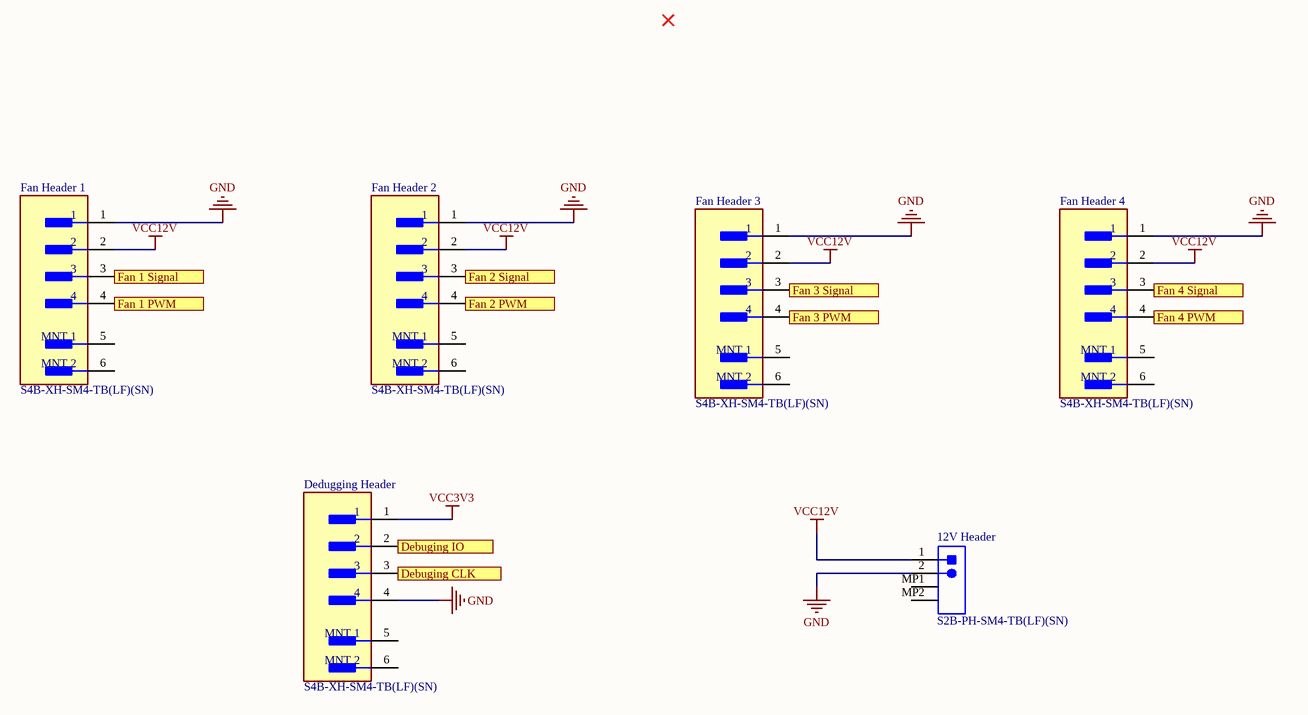
[diagram p5: Headers.SchDoc]

### Parts
12V_Header  S2B-PH-SM4-TB(LF)(SN)  [JST- S2B-PH-SM4-TB(LF)(SN)-2_V]
Dedugging_Header  S4B-XH-SM4-TB(LF)(SN)  [FP-S4B-XH-SM4-TB_LF_SN-MFG]
Fan_Header_1  S4B-XH-SM4-TB(LF)(SN)  [FP-S4B-XH-SM4-TB_LF_SN-MFG]
Fan_Header_2  S4B-XH-SM4-TB(LF)(SN)  [FP-S4B-XH-SM4-TB_LF_SN-MFG]
Fan_Header_3  S4B-XH-SM4-TB(LF)(SN)  [FP-S4B-XH-SM4-TB_LF_SN-MFG]
Fan_Header_4  S4B-XH-SM4-TB(LF)(SN)  [FP-S4B-XH-SM4-TB_LF_SN-MFG]

### Ports
Debuging CLK, Debuging IO, Fan 1 PWM, Fan 1 Signal, Fan 2 PWM, Fan 2 Signal (out), Fan 3 PWM, Fan 3 Signal, Fan 4 PWM, Fan 4 Signal

### Nets
GND: 12V_Header.2 Dedugging_Header.4 Fan_Header_1.1 Fan_Header_2.1 Fan_Header_3.1 Fan_Header_4.1
VCC3V3: Dedugging_Header.1
VCC12V: 12V_Header.1 Fan_Header_1.2 Fan_Header_2.2 Fan_Header_3.2 Fan_Header_4.2
Debuging CLK: Dedugging_Header.3 ; port Debuging CLK
Debuging IO: Dedugging_Header.2 ; port Debuging IO
Fan 1 PWM: Fan_Header_1.4 ; port Fan 1 PWM
Fan 1 Signal: Fan_Header_1.3 ; port Fan 1 Signal
Fan 2 PWM: Fan_Header_2.4 ; port Fan 2 PWM
Fan 2 Signal: Fan_Header_2.3 ; port Fan 2 Signal
Fan 3 PWM: Fan_Header_3.4 ; port Fan 3 PWM
Fan 3 Signal: Fan_Header_3.3 ; port Fan 3 Signal
Fan 4 PWM: Fan_Header_4.4 ; port Fan 4 PWM
Fan 4 Signal: Fan_Header_4.3 ; port Fan 4 Signal

Not connected (* = marked no-connect by the designer): 12V_Header MP1 MP2; Dedugging_Header 5(MNT_1) 6(MNT_2); Fan_Header_1 5(MNT_1) 6(MNT_2); Fan_Header_2 5(MNT_1) 6(MNT_2); Fan_Header_3 5(MNT_1) 6(MNT_2); Fan_Header_4 5(MNT_1) 6(MNT_2)

### Library data of the parts
12V_Header = CMP-1755-00001-1: Male Header, Pitch 2 mm, 1 x 2 Position, Height 5.5 mm, -25 to 85 degC, RoHS, Tape and Reel; Current Rating: 3 A; ComponentLink1URL: http://www.jst.com/home2.html; Radiation Hardening: No; RoHSCompliant: True; Mount: Through Hole; Contact Material: Bronze; Package Quantity: 100; Width: 2.34 mm; DatasheetVersion: Dec-12; Height: 8.13 mm; Max Operating Temperature: 105degC; ComponentLink2Description: Datasheet; Lead Pitch: 0.1 inch; Contact Finish: Lead; Packaging: Bulk; Colour: Black; Contact Plating: Tin; Min Operating Temperature: -65degC; ComponentLink1Description: Manufacturer URL; PackageReference: S2B-PH-SM4-TB(LF)(SN)-2; PackageDescription: Male Header, Pitch 2 mm, 1 x 2 Position, Height 5.5 mm; ComponentLink2URL: http://www.jst-mfg.com/product/pdf/eng/ePH.pdf; Pins: 40; Length: 101.19 mm
Dedugging_Header Fan_Header_1-Fan_Header_4 = CMP-17439-000072-1: CONN HEADER SMD R/A 4POS 2.5MM; Number of Positions: 4; Max Current Rating: 3A; Max Voltage Rating (AC): 250V; Connector Type: Male Pin; Contact Resistance: 20mR; Gender: Male; Pitch: 0.098inch; Max Operating Temperature: 85°C; Contact Plating: Tin; Housing Material: Polyamide; Housing Color: Beige; Depth: 10mm; Series: XH; Package Quantity: 1; Length: 15mm; Contact Material: Copper Alloy; Min Operating Temperature: -25°C; REACH SVHC: No SVHC; Orientation: Right Angle; Number of Rows: 1; Contact Type: Male Pin; Color: Natural; Lead Free: Lead Free; Termination: Solder; Mount: Surface Mount; Number of Contacts: 4; Packaging: Tape and Reel

## Nets that join several sheets
GND: STM (20 pins), CANsetup (C5.2 C6.2 CAN.2), Sensors (Temp_Sensor_1.3 Temp_Sensor_2.3 Temp_Sensor_3.3 Temp_Sensor_4.3), Power (9 pins), Headers (6 pins)
VCC3V3: STM (15 pins), CANsetup (C5.1 CAN.5), Sensors (Temp_Sensor_1.1 Temp_Sensor_2.1 Temp_Sensor_3.1 Temp_Sensor_4.1), Power (C4.2 IC2.5 R1.2), Headers (Dedugging_Header.1)
VCC5V: CANsetup (C6.1 CAN.3), Power (6 pins)
VCC12V: Power (C1.2 IC1.1 R3.2), Headers (5 pins)
CAN STBY: STM (U1.45), CANsetup (CAN.8)
CAN_RX: STM (U1.43), CANsetup (CAN.4)
CAN_TX: STM (U1.44), CANsetup (CAN.1)
Debuging CLK: STM (U1.58), Headers (Dedugging_Header.3)
Debuging IO: STM (U1.57), Headers (Dedugging_Header.2)
Fan 1 PWM: STM (U1.21), Headers (Fan_Header_1.4)
Fan 1 Signal: STM (U1.20), Headers (Fan_Header_1.3)
Fan 2 PWM: STM (U1.23), Headers (Fan_Header_2.4)
Fan 2 Signal: STM (U1.22), Headers (Fan_Header_2.3)
Fan 3 PWM: STM (U1.25), Headers (Fan_Header_3.4)
Fan 3 Signal: STM (U1.24), Headers (Fan_Header_3.3)
Fan 4 PWM: STM (U1.27), Headers (Fan_Header_4.4)
Fan 4 Signal: STM (U1.26), Headers (Fan_Header_4.3)
Temp 1: STM (U1.11), Sensors (Temp_Sensor_1.2)
Temp 2: STM (U1.9), Sensors (Temp_Sensor_2.2)
Temp 3: STM (U1.16), Sensors (Temp_Sensor_3.2)
Temp 4: STM (U1.10), Sensors (Temp_Sensor_4.2)